# Altium project Independent_Study_Amp_Board.PrjPcb
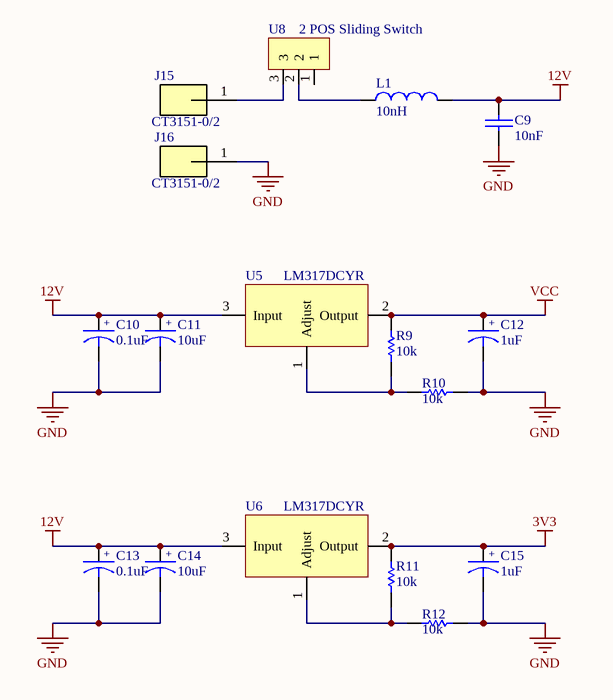
[diagram p0: Power.SchDoc]
3 sheets, 107 parts. Net scope: flat (ports and power ports of the same name join across sheets).
Board file: PCB_Template.PcbDoc
Sheets:
  Power.SchDoc
  FPGA_Socket.SchDoc
  Amplifier.SchDoc

## Sheet Power.SchDoc: Power
size A; Engineer: Benjamin Beaudoin; Revision: v0.1

### Parts
C9  10nF  [0603C]
C10  0.1uF  [0603C]
C11  10uF  [0603C]
C12  1uF  [0603C]
C13  0.1uF  [0603C]
C14  10uF  [0603C]
C15  1uF  [0603C]
J15  CT3151-0/2  [CT3151-0/2]
J16  CT3151-0/2  [CT3151-0/2]
L1  10nH  [0603C]
R9  10k  [0603C]
R10  10k  [0603C]
R11  10k  [0603C]
R12  10k  [0603C]
U5  LM317DCYR  [LM317]
U6  LM317DCYR  [LM317]
U8  2 POS Sliding Switch  [2 POS Sliding switch]

### Nets
3V3: C15.1 R11.2 U6.2(Output)
12V: C9.1 C10.1 C11.1 C13.1 C14.1 L1.2 U5.3(Input) U6.3(Input)
GND: C9.2 C10.2 C11.2 C12.2 C13.2 C14.2 C15.2 J16.1 R10.2 R12.2
VCC: C12.1 R9.2 U5.2(Output)
NetJ15_1: J15.1 U8.3
NetL1_1: L1.1 U8.2
NetR9_1: R9.1 R10.1 U5.1(Adjust)
NetR11_1: R11.1 R12.1 U6.1(Adjust)

Not connected (* = marked no-connect by the designer): U8 1

### Notes on the sheet
- (in symbol CPoly) +

### Library data of the parts
C9 = C: Capacitor; Power_WV_SRF: 25V; MFGPN: *; MFG: *; Value: 10nF; Tolerance: *; TempCo: *; Distributor: *; CMPN: *
C10-C15 = CPoly: Cap Poly; Power_WV_SRF: 35V; MFG: *; MFGPN: *; Tolerance: *; Temp Coef: *; Distributor Reg Num: *; Distributor: *; CMPN: *
  C10 C13: Value: 0.1uF
  C11 C14: Value: 10uF
  C12 C15: Value: 1uF
J15 J16 = CT3151-0/2: CONN BANANA JACK SOLDER BLACK; MF: Cal Test Electronics; Digi-Key_Purchase_URL: https://www.digikey.com/product-detail/en/cal-test-electronics/CT3151-0/BKCT3151-0-ND/6005441; Digi-Key_Part_Number: BKCT3151-0-ND; Package: None; SnapEDA_Link: CT3151-2; MP: CT3151-0	/2; Value: *
L1 = L: Inductor; MFG: *; MFGPN: *; Value: 10nH; Tolerance: *; Current: *; Power_WV_SRF: *; Distributor: *; CMPN: *
R9-R12 = R: Resistor; Tolerance: 5%; Value: 10k; Power_WV_SRF: *; MFG: *; MFGPN: *; Distributor: *; CMPN: *
U5 U6 = LM317

## Sheet FPGA_Socket.SchDoc: FPGA_Socket
size OrCAD A; Engineer: Benjamin Beaudoin; Revision: vX.X
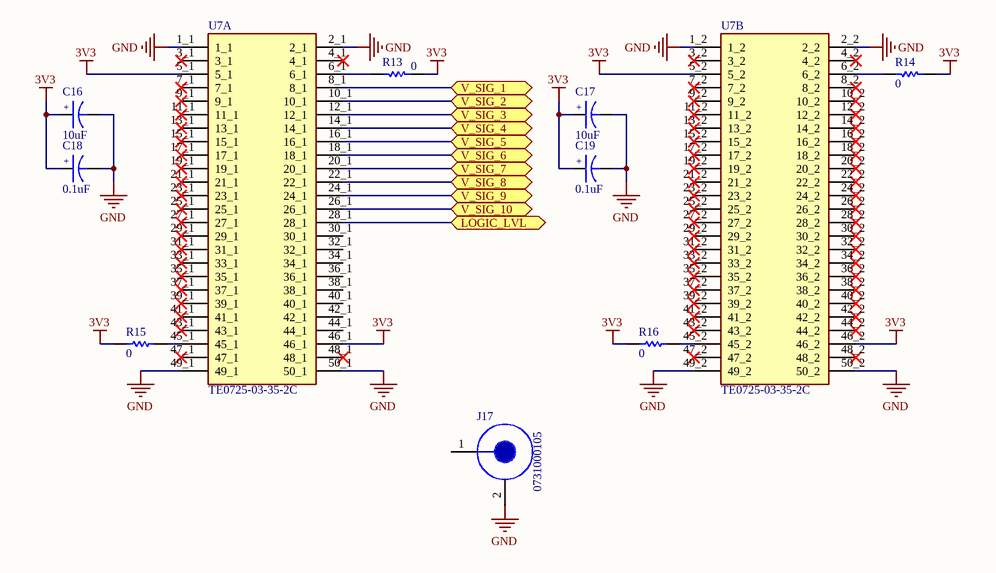
[diagram p1: FPGA_Socket.SchDoc]

### Parts
C16  10uF  [0603C]
C17  10uF  [0603C]
C18  0.1uF  [0603C]
C19  0.1uF  [0603C]
J17  0731000105  [0731000105]
R13  0  [0603C]
R14  0  [0603C]
R15  0  [0603C]
R16  0  [0603C]
U7  TE0725-03-35-2C  [MODULE_TE0725-03-35-2C]  (parts A,B of 2)

### Ports
LOGIC_LVL, V_SIG_1, V_SIG_2, V_SIG_3, V_SIG_4, V_SIG_5, V_SIG_6, V_SIG_7, V_SIG_8, V_SIG_9, V_SIG_10

### Nets
3V3: C16.1 C17.1 C18.1 C19.1 R13.1 R14.1 R15.1 R16.1 U7.5_1 U7.5_2 U7.46_1 U7.46_2
GND: C16.2 C17.2 C18.2 C19.2 J17.2 U7.1_1 U7.1_2 U7.2_1 U7.2_2 U7.49_1 U7.49_2 U7.50_1 U7.50_2
NetR1_2: U7.28_1 ; port LOGIC_LVL
NetR13_2: R13.2 U7.6_1
NetR14_2: R14.2 U7.6_2
NetR15_2: R15.2 U7.45_1
NetR16_2: R16.2 U7.45_2
NetU1_1: U7.8_1 ; port V_SIG_1
NetU2_1: U7.20_1 ; port V_SIG_7
NetU3_1: U7.10_1 ; port V_SIG_2
NetU4_1: U7.22_1 ; port V_SIG_8
NetU7_12_1: U7.12_1 ; port V_SIG_3
NetU7_14_1: U7.14_1 ; port V_SIG_4
NetU7_16_1: U7.16_1 ; port V_SIG_5
NetU7_18_1: U7.18_1 ; port V_SIG_6
NetU7_24_1: U7.24_1 ; port V_SIG_9
NetU7_26_1: U7.26_1 ; port V_SIG_10

Not connected (* = marked no-connect by the designer): J17 1; U7 3_1* 3_2* 4_1* 4_2* 7_1* 7_2* 8_2* 9_1* 9_2* 10_2* 11_1* 11_2* 12_2* 13_1* 13_2* 14_2* 15_1* 15_2* 16_2* 17_1* 17_2* 18_2* 19_1* 19_2* 20_2* 21_1* 21_2* 22_2* 23_1* 23_2* 24_2* 25_1* 25_2* 26_2* 27_1* 27_2* 28_2* 29_1* 29_2* 30_1 30_2* 31_1* 31_2* 32_1 32_2* 33_1* 33_2* 34_1 34_2* 35_1* 35_2* 36_1 36_2* 37_1* 37_2* 38_1 38_2* 39_1* 39_2* 40_1 40_2* 41_1* 41_2* 42_1 42_2* 43_1* 43_2* 44_1 44_2* 47_1* 47_2* 48_1* 48_2*

### Notes on the sheet
- (in symbol CPoly) +

### Library data of the parts
C16-C19 = CPoly: Cap Poly; Power_WV_SRF: 35V; MFG: *; MFGPN: *; Tolerance: *; Temp Coef: *; Distributor Reg Num: *; Distributor: *; CMPN: *
  C16 C17: Value: 10uF
  C18 C19: Value: 0.1uF
J17 = 0731000105: BNC Connector Jack, Female Socket 50Ohm Through Hole, Right Angle Solder
R13-R16 = R: Resistor; Tolerance: 5%; Value: 0; Power_WV_SRF: *; MFG: *; MFGPN: *; Distributor: *; CMPN: *
U7 = TE0725-03-35-2C: TE0725 Embedded Module Artix-7 A35T 100MHz 32MB; MF: Trenz Electronic GmbH; Package: Trenz Electronic GmbH; Value: *; Availability: Unavailable; SnapEDA_Link: https://www.snapeda.com/parts/TE0725-03-35-2C/Trenz%20Electronic%20GmbH/view-part/4794770/?ref=snap; MP: TE0725-03-35-2C; Price: None

## Sheet Amplifier.SchDoc: Amplifier
size C; Engineer: Benjamin Beaudoin; Revision: v0.1
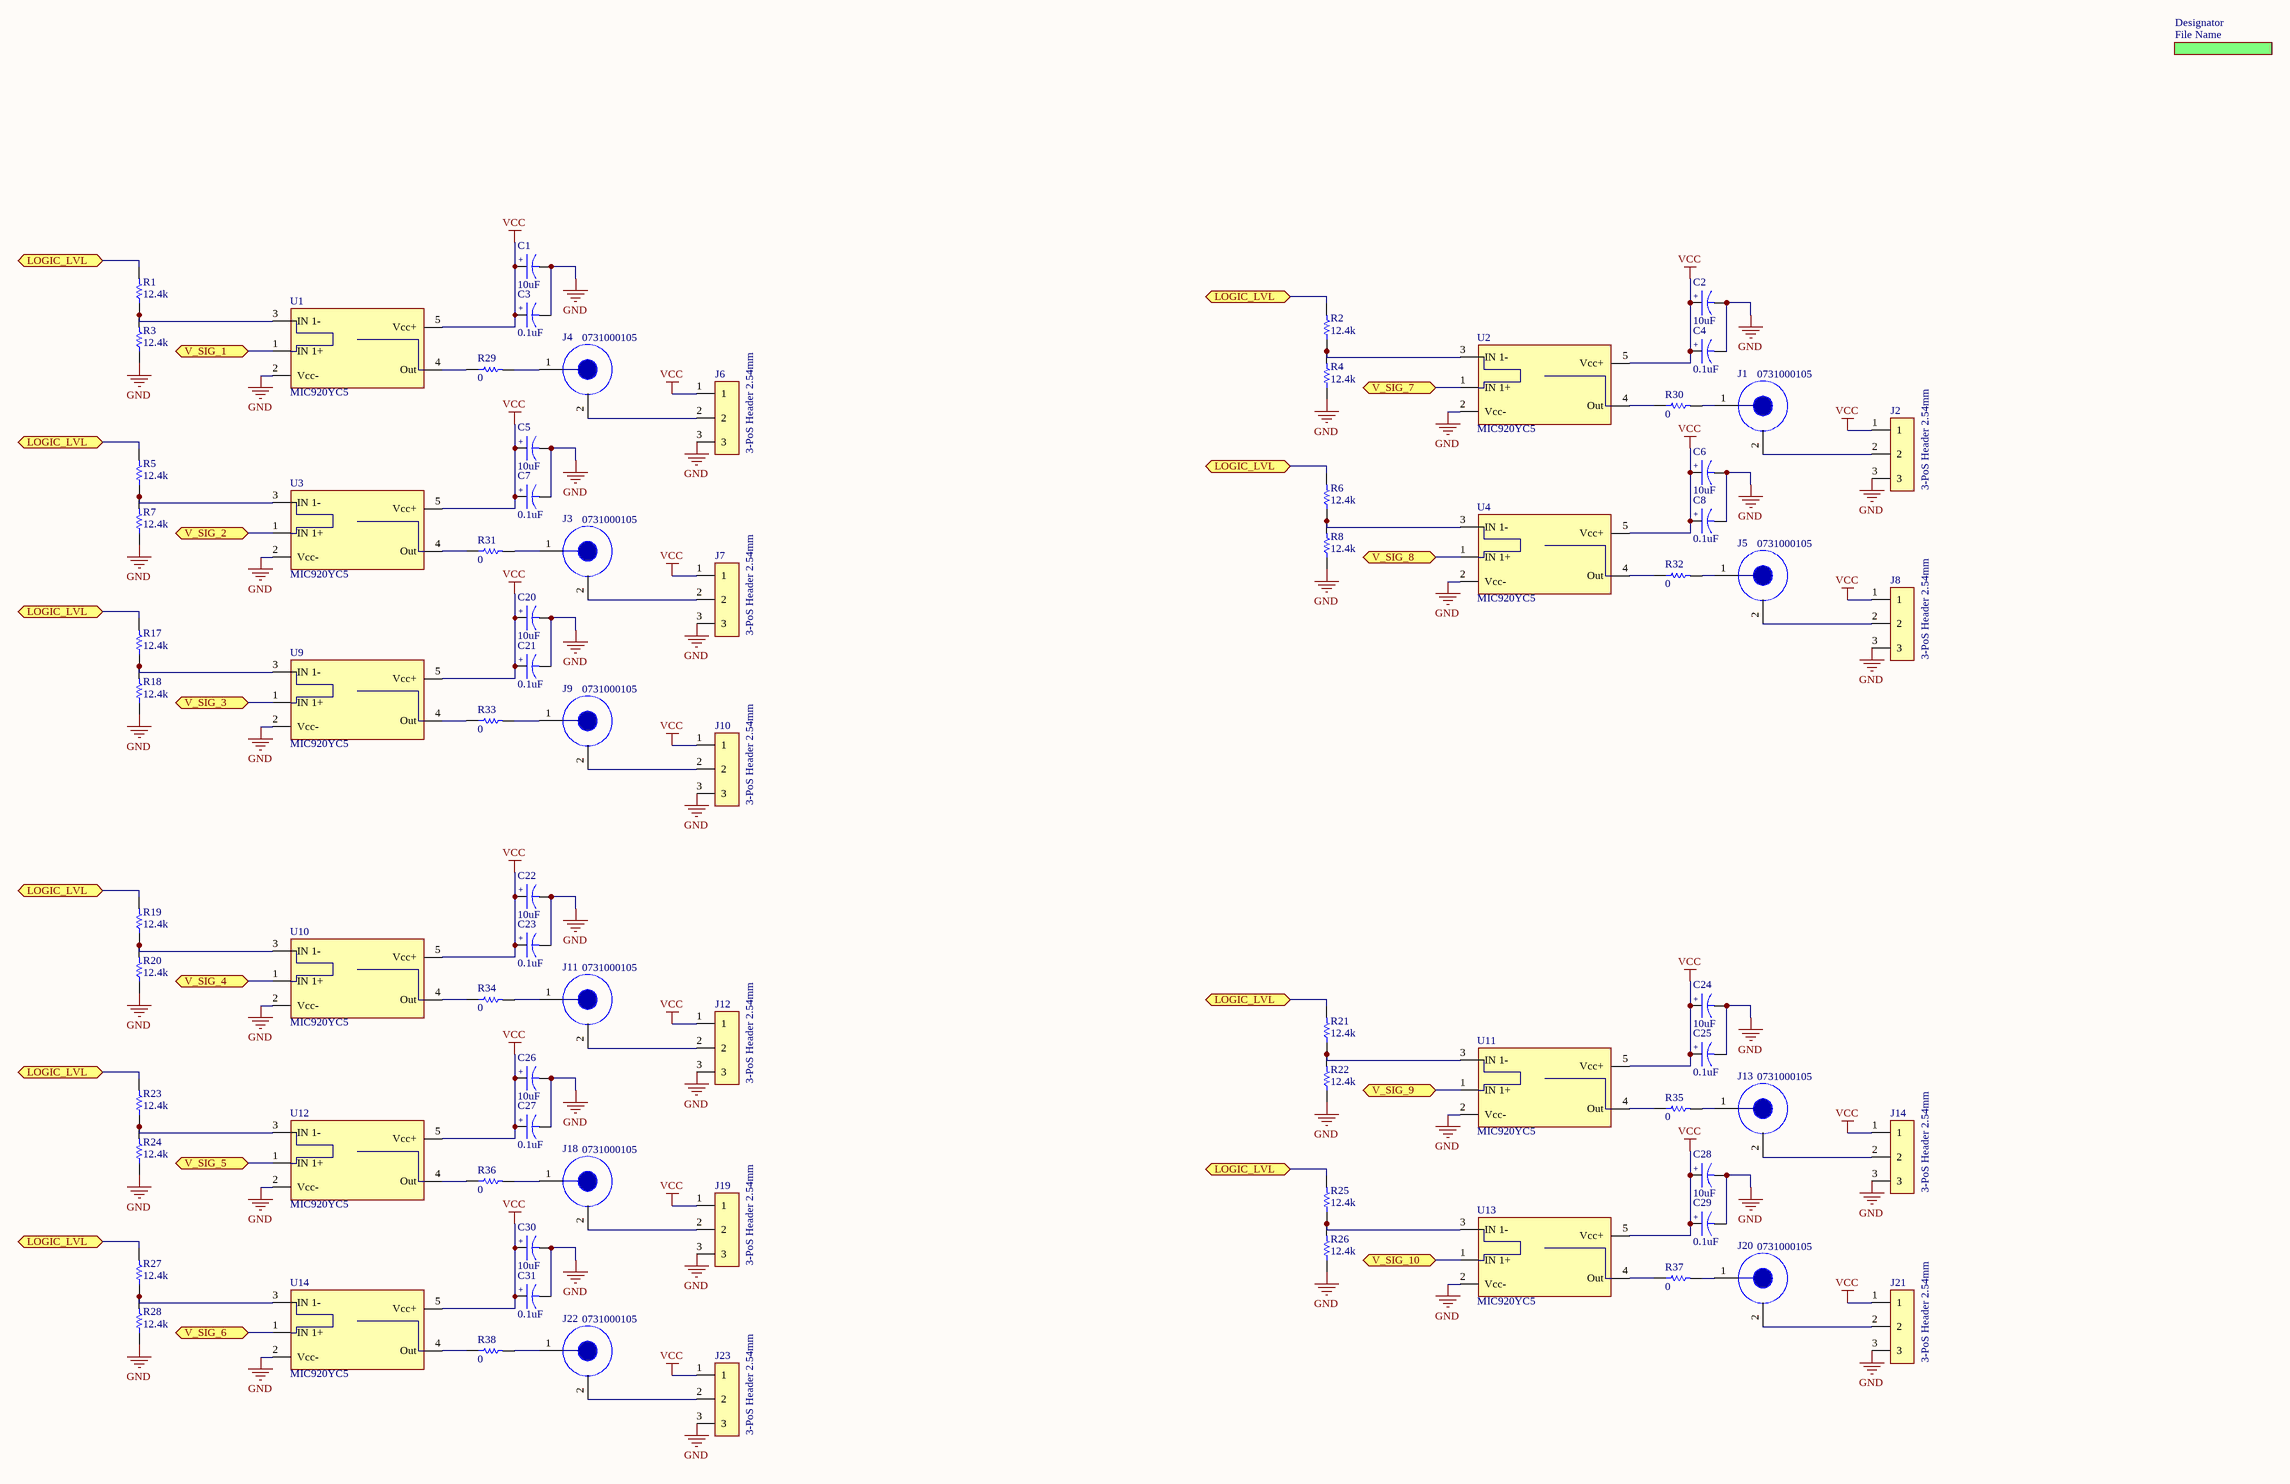
[diagram p2: Amplifier.SchDoc]

### Parts
C1  10uF  [0603C]
C2  10uF  [0603C]
C3  0.1uF  [0603C]
C4  0.1uF  [0603C]
C5  10uF  [0603C]
C6  10uF  [0603C]
C7  0.1uF  [0603C]
C8  0.1uF  [0603C]
C20  10uF  [0603C]
C21  0.1uF  [0603C]
C22  10uF  [0603C]
C23  0.1uF  [0603C]
C24  10uF  [0603C]
C25  0.1uF  [0603C]
C26  10uF  [0603C]
C27  0.1uF  [0603C]
C28  10uF  [0603C]
C29  0.1uF  [0603C]
C30  10uF  [0603C]
C31  0.1uF  [0603C]
J1  0731000105  [0731000105]
J2  3-PoS Header 2.54mm  [3-POS 2.54mm Pitch Header - duplicate]
J3  0731000105  [0731000105]
J4  0731000105  [0731000105]
J5  0731000105  [0731000105]
J6  3-PoS Header 2.54mm  [3-POS 2.54mm Pitch Header - duplicate]
J7  3-PoS Header 2.54mm  [3-POS 2.54mm Pitch Header - duplicate]
J8  3-PoS Header 2.54mm  [3-POS 2.54mm Pitch Header - duplicate]
J9  0731000105  [0731000105]
J10  3-PoS Header 2.54mm  [3-POS 2.54mm Pitch Header - duplicate]
J11  0731000105  [0731000105]
J12  3-PoS Header 2.54mm  [3-POS 2.54mm Pitch Header - duplicate]
J13  0731000105  [0731000105]
J14  3-PoS Header 2.54mm  [3-POS 2.54mm Pitch Header - duplicate]
J18  0731000105  [0731000105]
J19  3-PoS Header 2.54mm  [3-POS 2.54mm Pitch Header - duplicate]
J20  0731000105  [0731000105]
J21  3-PoS Header 2.54mm  [3-POS 2.54mm Pitch Header - duplicate]
J22  0731000105  [0731000105]
J23  3-PoS Header 2.54mm  [3-POS 2.54mm Pitch Header - duplicate]
R1  12.4k  [0603C]
R2  12.4k  [0603C]
R3  12.4k  [0603C]
R4  12.4k  [0603C]
R5  12.4k  [0603C]
R6  12.4k  [0603C]
R7  12.4k  [0603C]
R8  12.4k  [0603C]
R17  12.4k  [0603C]
R18  12.4k  [0603C]
R19  12.4k  [0603C]
R20  12.4k  [0603C]
R21  12.4k  [0603C]
R22  12.4k  [0603C]
R23  12.4k  [0603C]
R24  12.4k  [0603C]
R25  12.4k  [0603C]
R26  12.4k  [0603C]
R27  12.4k  [0603C]
R28  12.4k  [0603C]
R29  0  [1206C]
R30  0  [1206C]
R31  0  [1206C]
R32  0  [1206C]
R33  0  [1206C]
R34  0  [1206C]
R35  0  [1206C]
R36  0  [1206C]
R37  0  [1206C]
R38  0  [1206C]
U1  MIC920YC5  [MIC920]
U2  MIC920YC5  [MIC920]
U3  MIC920YC5  [MIC920]
U4  MIC920YC5  [MIC920]
U9  MIC920YC5  [MIC920]
U10  MIC920YC5  [MIC920]
U11  MIC920YC5  [MIC920]
U12  MIC920YC5  [MIC920]
U13  MIC920YC5  [MIC920]
U14  MIC920YC5  [MIC920]

### Sub-sheets
Designator = File Name (file not in this document): no entries

### Ports
LOGIC_LVL, V_SIG_1, V_SIG_2, V_SIG_3, V_SIG_4, V_SIG_5, V_SIG_6, V_SIG_7, V_SIG_8, V_SIG_9, V_SIG_10

### Nets
GND: C1.2 C2.2 C3.2 C4.2 C5.2 C6.2 C7.2 C8.2 C20.2 C21.2 C22.2 C23.2 C24.2 C25.2 C26.2 C27.2 C28.2 C29.2 C30.2 C31.2 J2.3 J6.3 J7.3 J8.3 J10.3 J12.3 J14.3 J19.3 J21.3 J23.3 R3.1 R4.1 R7.1 R8.1 R18.1 R20.1 R22.1 R24.1 R26.1 R28.1 U1.2(Vcc-) U2.2(Vcc-) U3.2(Vcc-) U4.2(Vcc-) U9.2(Vcc-) U10.2(Vcc-) U11.2(Vcc-) U12.2(Vcc-) U13.2(Vcc-) U14.2(Vcc-)
VCC: C1.1 C2.1 C3.1 C4.1 C5.1 C6.1 C7.1 C8.1 C20.1 C21.1 C22.1 C23.1 C24.1 C25.1 C26.1 C27.1 C28.1 C29.1 C30.1 C31.1 J2.1 J6.1 J7.1 J8.1 J10.1 J12.1 J14.1 J19.1 J21.1 J23.1 U1.5(Vcc+) U2.5(Vcc+) U3.5(Vcc+) U4.5(Vcc+) U9.5(Vcc+) U10.5(Vcc+) U11.5(Vcc+) U12.5(Vcc+) U13.5(Vcc+) U14.5(Vcc+)
NetJ1_1: J1.1 R30.2
NetJ1_2: J1.2 J2.2
NetJ3_1: J3.1 R31.2
NetJ3_2: J3.2 J7.2
NetJ4_1: J4.1 R29.2
NetJ4_2: J4.2 J6.2
NetJ5_1: J5.1 R32.2
NetJ5_2: J5.2 J8.2
NetJ9_1: J9.1 R33.2
NetJ9_2: J9.2 J10.2
NetJ11_1: J11.1 R34.2
NetJ11_2: J11.2 J12.2
NetJ13_1: J13.1 R35.2
NetJ13_2: J13.2 J14.2
NetJ18_1: J18.1 R36.2
NetJ18_2: J18.2 J19.2
NetJ20_1: J20.1 R37.2
NetJ20_2: J20.2 J21.2
NetJ22_1: J22.1 R38.2
NetJ22_2: J22.2 J23.2
NetR1_1: R1.1 R3.2 U1.3(IN_1-)
NetR1_2: R1.2 R2.2 R5.2 R6.2 R17.2 R19.2 R21.2 R23.2 R25.2 R27.2 ; port LOGIC_LVL
NetR2_1: R2.1 R4.2 U2.3(IN_1-)
NetR5_1: R5.1 R7.2 U3.3(IN_1-)
NetR6_1: R6.1 R8.2 U4.3(IN_1-)
NetR17_1: R17.1 R18.2 U9.3(IN_1-)
NetR19_1: R19.1 R20.2 U10.3(IN_1-)
NetR21_1: R21.1 R22.2 U11.3(IN_1-)
NetR23_1: R23.1 R24.2 U12.3(IN_1-)
NetR25_1: R25.1 R26.2 U13.3(IN_1-)
NetR27_1: R27.1 R28.2 U14.3(IN_1-)
NetR29_1: R29.1 U1.4(Out)
NetR30_1: R30.1 U2.4(Out)
NetR31_1: R31.1 U3.4(Out)
NetR32_1: R32.1 U4.4(Out)
NetR33_1: R33.1 U9.4(Out)
NetR34_1: R34.1 U10.4(Out)
NetR35_1: R35.1 U11.4(Out)
NetR36_1: R36.1 U12.4(Out)
NetR37_1: R37.1 U13.4(Out)
NetR38_1: R38.1 U14.4(Out)
NetU1_1: U1.1(IN_1+) ; port V_SIG_1
NetU2_1: U2.1(IN_1+) ; port V_SIG_7
NetU3_1: U3.1(IN_1+) ; port V_SIG_2
NetU4_1: U4.1(IN_1+) ; port V_SIG_8
NetU7_12_1: U9.1(IN_1+) ; port V_SIG_3
NetU7_14_1: U10.1(IN_1+) ; port V_SIG_4
NetU7_16_1: U12.1(IN_1+) ; port V_SIG_5
NetU7_18_1: U14.1(IN_1+) ; port V_SIG_6
NetU7_24_1: U11.1(IN_1+) ; port V_SIG_9
NetU7_26_1: U13.1(IN_1+) ; port V_SIG_10

### Notes on the sheet
- (in symbol CPoly) +

### Library data of the parts
C1-C8 C20-C31 = CPoly: Cap Poly; Power_WV_SRF: 35V; MFG: *; MFGPN: *; Tolerance: *; Temp Coef: *; Distributor Reg Num: *; Distributor: *; CMPN: *
  C1 C2 C5 C6 C20 C22 C24 C26 C28 C30: Value: 10uF
  C3 C4 C7 C8 C21 C23 C25 C27 C29 C31: Value: 0.1uF
J1 J3-J5 J9 J11 J13 J18 J20 J22 = 0731000105: as J17 on sheet FPGA_Socket
J2 J6-J8 J10 J12 J14 J19 J21 J23 = 3-PoS Header
R1-R8 R17-R38 = R: Resistor; Tolerance: 5%; Power_WV_SRF: *; MFG: *; MFGPN: *; Distributor: *; CMPN: *
  R1-R8 R17-R28: Value: 12.4k
  R29-R38: Value: 0
U1-U4 U9-U14 = MIC920YC5-TR: General Purpose Amplifier 1 Circuit SC-70-5

## Nets that join several sheets
3V3: Power (C15.1 R11.2 U6.2), FPGA_Socket (12 pins)
GND: Power (10 pins), FPGA_Socket (13 pins), Amplifier (50 pins)
VCC: Power (C12.1 R9.2 U5.2), Amplifier (40 pins)
NetR1_2: FPGA_Socket (U7.28_1), Amplifier (10 pins)
NetU1_1: FPGA_Socket (U7.8_1), Amplifier (U1.1)
NetU2_1: FPGA_Socket (U7.20_1), Amplifier (U2.1)
NetU3_1: FPGA_Socket (U7.10_1), Amplifier (U3.1)
NetU4_1: FPGA_Socket (U7.22_1), Amplifier (U4.1)
NetU7_12_1: FPGA_Socket (U7.12_1), Amplifier (U9.1)
NetU7_14_1: FPGA_Socket (U7.14_1), Amplifier (U10.1)
NetU7_16_1: FPGA_Socket (U7.16_1), Amplifier (U12.1)
NetU7_18_1: FPGA_Socket (U7.18_1), Amplifier (U14.1)
NetU7_24_1: FPGA_Socket (U7.24_1), Amplifier (U11.1)
NetU7_26_1: FPGA_Socket (U7.26_1), Amplifier (U13.1)